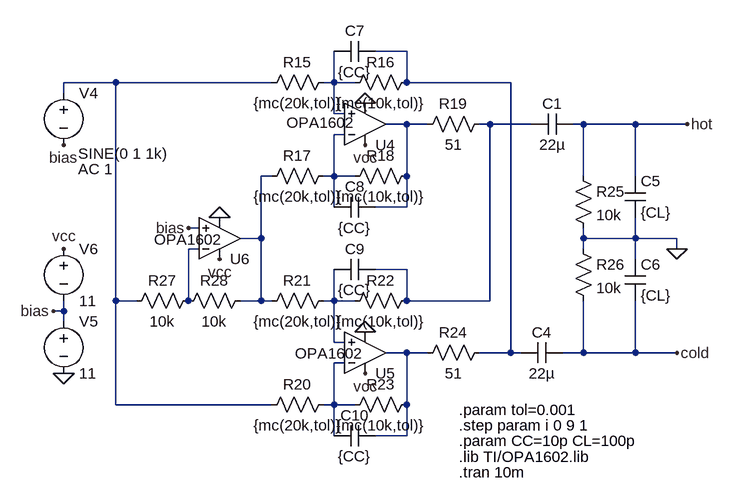
[diagram p0: schematic LineDriver-sensitivity.asc]
LineDriver-sensitivity.asc, the LTspice schematic file:
Version 4
SHEET 1 880 680
WIRE -432 -1072 -480 -1072
WIRE -880 -1024 -960 -1024
WIRE -640 -1024 -880 -1024
WIRE -544 -1024 -544 -1072
WIRE -544 -1024 -560 -1024
WIRE -512 -1024 -544 -1024
WIRE -432 -1024 -432 -1072
WIRE -272 -1024 -432 -1024
WIRE -960 -1008 -960 -1024
WIRE -544 -976 -544 -1024
WIRE -528 -976 -544 -976
WIRE -432 -960 -464 -960
WIRE -400 -960 -432 -960
WIRE -304 -960 -320 -960
WIRE -240 -960 -304 -960
WIRE -160 -960 -176 -960
WIRE -80 -960 -160 -960
WIRE 0 -960 -80 -960
WIRE -528 -944 -544 -944
WIRE -640 -880 -656 -880
WIRE -544 -880 -544 -944
WIRE -544 -880 -560 -880
WIRE -512 -880 -544 -880
WIRE -432 -880 -432 -960
WIRE -160 -880 -160 -960
WIRE -80 -880 -80 -960
WIRE -544 -832 -544 -880
WIRE -432 -832 -432 -880
WIRE -432 -832 -480 -832
WIRE -752 -800 -768 -800
WIRE -656 -784 -656 -880
WIRE -656 -784 -688 -784
WIRE -160 -784 -160 -800
WIRE -80 -784 -80 -816
WIRE -80 -784 -160 -784
WIRE -16 -784 -80 -784
WIRE -752 -768 -768 -768
WIRE -160 -768 -160 -784
WIRE -16 -768 -16 -784
WIRE -80 -752 -80 -784
WIRE -432 -736 -480 -736
WIRE -880 -688 -880 -1024
WIRE -848 -688 -880 -688
WIRE -768 -688 -768 -768
WIRE -656 -688 -656 -784
WIRE -656 -688 -688 -688
WIRE -640 -688 -656 -688
WIRE -544 -688 -544 -736
WIRE -544 -688 -560 -688
WIRE -512 -688 -544 -688
WIRE -432 -688 -432 -736
WIRE -304 -688 -304 -960
WIRE -304 -688 -432 -688
WIRE -960 -672 -960 -688
WIRE -960 -672 -976 -672
WIRE -960 -656 -960 -672
WIRE -544 -624 -544 -688
WIRE -528 -624 -544 -624
WIRE -432 -608 -464 -608
WIRE -400 -608 -432 -608
WIRE -272 -608 -272 -1024
WIRE -272 -608 -320 -608
WIRE -256 -608 -272 -608
WIRE -160 -608 -160 -688
WIRE -160 -608 -192 -608
WIRE -80 -608 -80 -688
WIRE -80 -608 -160 -608
WIRE -16 -608 -80 -608
WIRE -528 -592 -544 -592
WIRE -880 -528 -880 -688
WIRE -640 -528 -880 -528
WIRE -544 -528 -544 -592
WIRE -544 -528 -560 -528
WIRE -512 -528 -544 -528
WIRE -432 -528 -432 -608
WIRE -544 -480 -544 -528
WIRE -432 -480 -432 -528
WIRE -432 -480 -480 -480
FLAG -16 -768 0
FLAG 0 -960 hot
FLAG -16 -608 cold
FLAG -960 -576 0
FLAG -976 -672 bias
FLAG -768 -800 bias
FLAG -960 -768 vcc
FLAG -960 -928 bias
FLAG -496 -992 0
FLAG -496 -640 0
FLAG -720 -816 0
FLAG -496 -928 vcc
FLAG -496 -576 vcc
FLAG -720 -752 vcc
SYMBOL voltage -960 -1024 R0
WINDOW 3 22 109 Left 2
WINDOW 123 22 133 Left 2
WINDOW 39 22 137 Left 2
SYMATTR Value SINE(0 1 1k)
SYMATTR Value2 AC 1
SYMATTR InstName V4
SYMBOL res -544 -1040 R90
WINDOW 0 0 56 VBottom 2
WINDOW 3 32 56 VTop 2
SYMATTR InstName R15
SYMATTR Value {mc(20k,tol)}
SYMBOL res -416 -1040 R90
WINDOW 0 0 56 VBottom 2
WINDOW 3 32 56 VTop 2
SYMATTR InstName R16
SYMATTR Value {mc(10k,tol)}
SYMBOL res -544 -896 R90
WINDOW 0 0 56 VBottom 2
WINDOW 3 32 56 VTop 2
SYMATTR InstName R17
SYMATTR Value {mc(20k,tol)}
SYMBOL res -416 -896 R90
WINDOW 0 0 56 VBottom 2
WINDOW 3 32 56 VTop 2
SYMATTR InstName R18
SYMATTR Value {mc(10k,tol)}
SYMBOL res -416 -944 R270
WINDOW 0 32 56 VTop 2
WINDOW 3 0 56 VBottom 2
SYMATTR InstName R19
SYMATTR Value 51
SYMBOL res -544 -544 R90
WINDOW 0 0 56 VBottom 2
WINDOW 3 32 56 VTop 2
SYMATTR InstName R20
SYMATTR Value {mc(20k,tol)}
SYMBOL res -544 -704 R90
WINDOW 0 0 56 VBottom 2
WINDOW 3 32 56 VTop 2
SYMATTR InstName R21
SYMATTR Value {mc(20k,tol)}
SYMBOL res -416 -704 R90
WINDOW 0 0 56 VBottom 2
WINDOW 3 32 56 VTop 2
SYMATTR InstName R22
SYMATTR Value {mc(10k,tol)}
SYMBOL res -416 -544 R90
WINDOW 0 0 56 VBottom 2
WINDOW 3 32 56 VTop 2
SYMATTR InstName R23
SYMATTR Value {mc(10k,tol)}
SYMBOL res -416 -592 R270
WINDOW 0 32 56 VTop 2
WINDOW 3 0 56 VBottom 2
SYMATTR InstName R24
SYMATTR Value 51
SYMBOL res -176 -896 R0
SYMATTR InstName R25
SYMATTR Value 10k
SYMBOL res -176 -784 R0
SYMATTR InstName R26
SYMATTR Value 10k
SYMBOL cap -240 -944 R270
WINDOW 0 32 32 VTop 2
WINDOW 3 0 32 VBottom 2
SYMATTR InstName C1
SYMATTR Value 22µ
SYMBOL cap -256 -592 R270
WINDOW 0 32 32 VTop 2
WINDOW 3 0 32 VBottom 2
SYMATTR InstName C4
SYMATTR Value 22µ
SYMBOL res -752 -704 R90
WINDOW 0 0 56 VBottom 2
WINDOW 3 32 56 VTop 2
SYMATTR InstName R27
SYMATTR Value 10k
SYMBOL res -672 -704 R90
WINDOW 0 0 56 VBottom 2
WINDOW 3 32 56 VTop 2
SYMATTR InstName R28
SYMATTR Value 10k
SYMBOL voltage -960 -672 R0
WINDOW 123 0 0 Left 0
WINDOW 39 0 0 Left 0
SYMATTR InstName V5
SYMATTR Value 11
SYMBOL Opamps\\opamp2 -496 -896 M180
WINDOW 3 -121 66 Left 2
SYMATTR Value OPA1602
SYMATTR InstName U4
SYMBOL Opamps\\opamp2 -496 -544 M180
WINDOW 3 -108 63 Left 2
SYMATTR Value OPA1602
SYMATTR InstName U5
SYMBOL Opamps\\opamp2 -720 -720 M180
WINDOW 3 -101 62 Left 2
SYMATTR Value OPA1602
SYMATTR InstName U6
SYMBOL voltage -960 -784 R0
WINDOW 123 0 0 Left 0
WINDOW 39 0 0 Left 0
SYMATTR InstName V6
SYMATTR Value 11
SYMBOL cap -96 -880 R0
SYMATTR InstName C5
SYMATTR Value {CL}
SYMBOL cap -96 -752 R0
SYMATTR InstName C6
SYMATTR Value {CL}
SYMBOL cap -480 -1088 R90
WINDOW 0 0 32 VBottom 2
WINDOW 3 32 32 VTop 2
SYMATTR InstName C7
SYMATTR Value {CC}
SYMBOL cap -480 -848 R90
WINDOW 0 0 32 VBottom 2
WINDOW 3 32 32 VTop 2
SYMATTR InstName C8
SYMATTR Value {CC}
SYMBOL cap -480 -752 R90
WINDOW 0 0 32 VBottom 2
WINDOW 3 32 32 VTop 2
SYMATTR InstName C9
SYMATTR Value {CC}
SYMBOL cap -480 -496 R90
WINDOW 0 0 32 VBottom 2
WINDOW 3 32 32 VTop 2
SYMATTR InstName C10
SYMATTR Value {CC}
TEXT -352 -424 Left 2 !.tran 10m
TEXT -352 -472 Left 2 !.param CC=10p CL=100p
TEXT -352 -448 Left 2 !.lib TI/OPA1602.lib
TEXT -352 -520 Left 2 !.param tol=0.001
TEXT -352 -496 Left 2 !.step param i 0 9 1

The netlist it stands for:
* LineDriver-sensitivity.asc
V4 N002 bias SINE(0 1 1k) AC 1
R15 N003 N002 {mc(20k,tol)}
R16 N001 N003 {mc(10k,tol)}
R17 N006 N007 {mc(20k,tol)}
R18 N004 N006 {mc(10k,tol)}
R19 N004 N005 51
R20 N011 N002 {mc(20k,tol)}
R21 N009 N007 {mc(20k,tol)}
R22 N005 N009 {mc(10k,tol)}
R23 N010 N011 {mc(10k,tol)}
R24 N010 N001 51
R25 hot 0 10k
R26 0 cold 10k
C1 N005 hot 22µ
C4 N001 cold 22µ
R27 N008 N002 10k
R28 N007 N008 10k
V5 bias 0 11
XU4 N003 N006 vcc 0 N004 OPA1602  ; pins In+ In- V+ V- OUT
XU5 N009 N011 vcc 0 N010 OPA1602  ; pins In+ In- V+ V- OUT
XU6 bias N008 vcc 0 N007 OPA1602  ; pins In+ In- V+ V- OUT
V6 vcc bias 11
C5 hot 0 {CL}
C6 0 cold {CL}
C7 N001 N003 {CC}
C8 N004 N006 {CC}
C9 N005 N009 {CC}
C10 N010 N011 {CC}
.tran 10m
.param CC=10p CL=100p
.lib TI/OPA1602.lib
.param tol=0.001
.step param i 0 9 1
.backanno
.end